# Altium schematic sheet power.SchDoc: Electrical Power System
size A3; Organization: Tweetonig; Address1: Delftsestraat 11; DocumentNumber: 2; Revision: 1.0; SheetNumber: 2; SheetTotal: 9
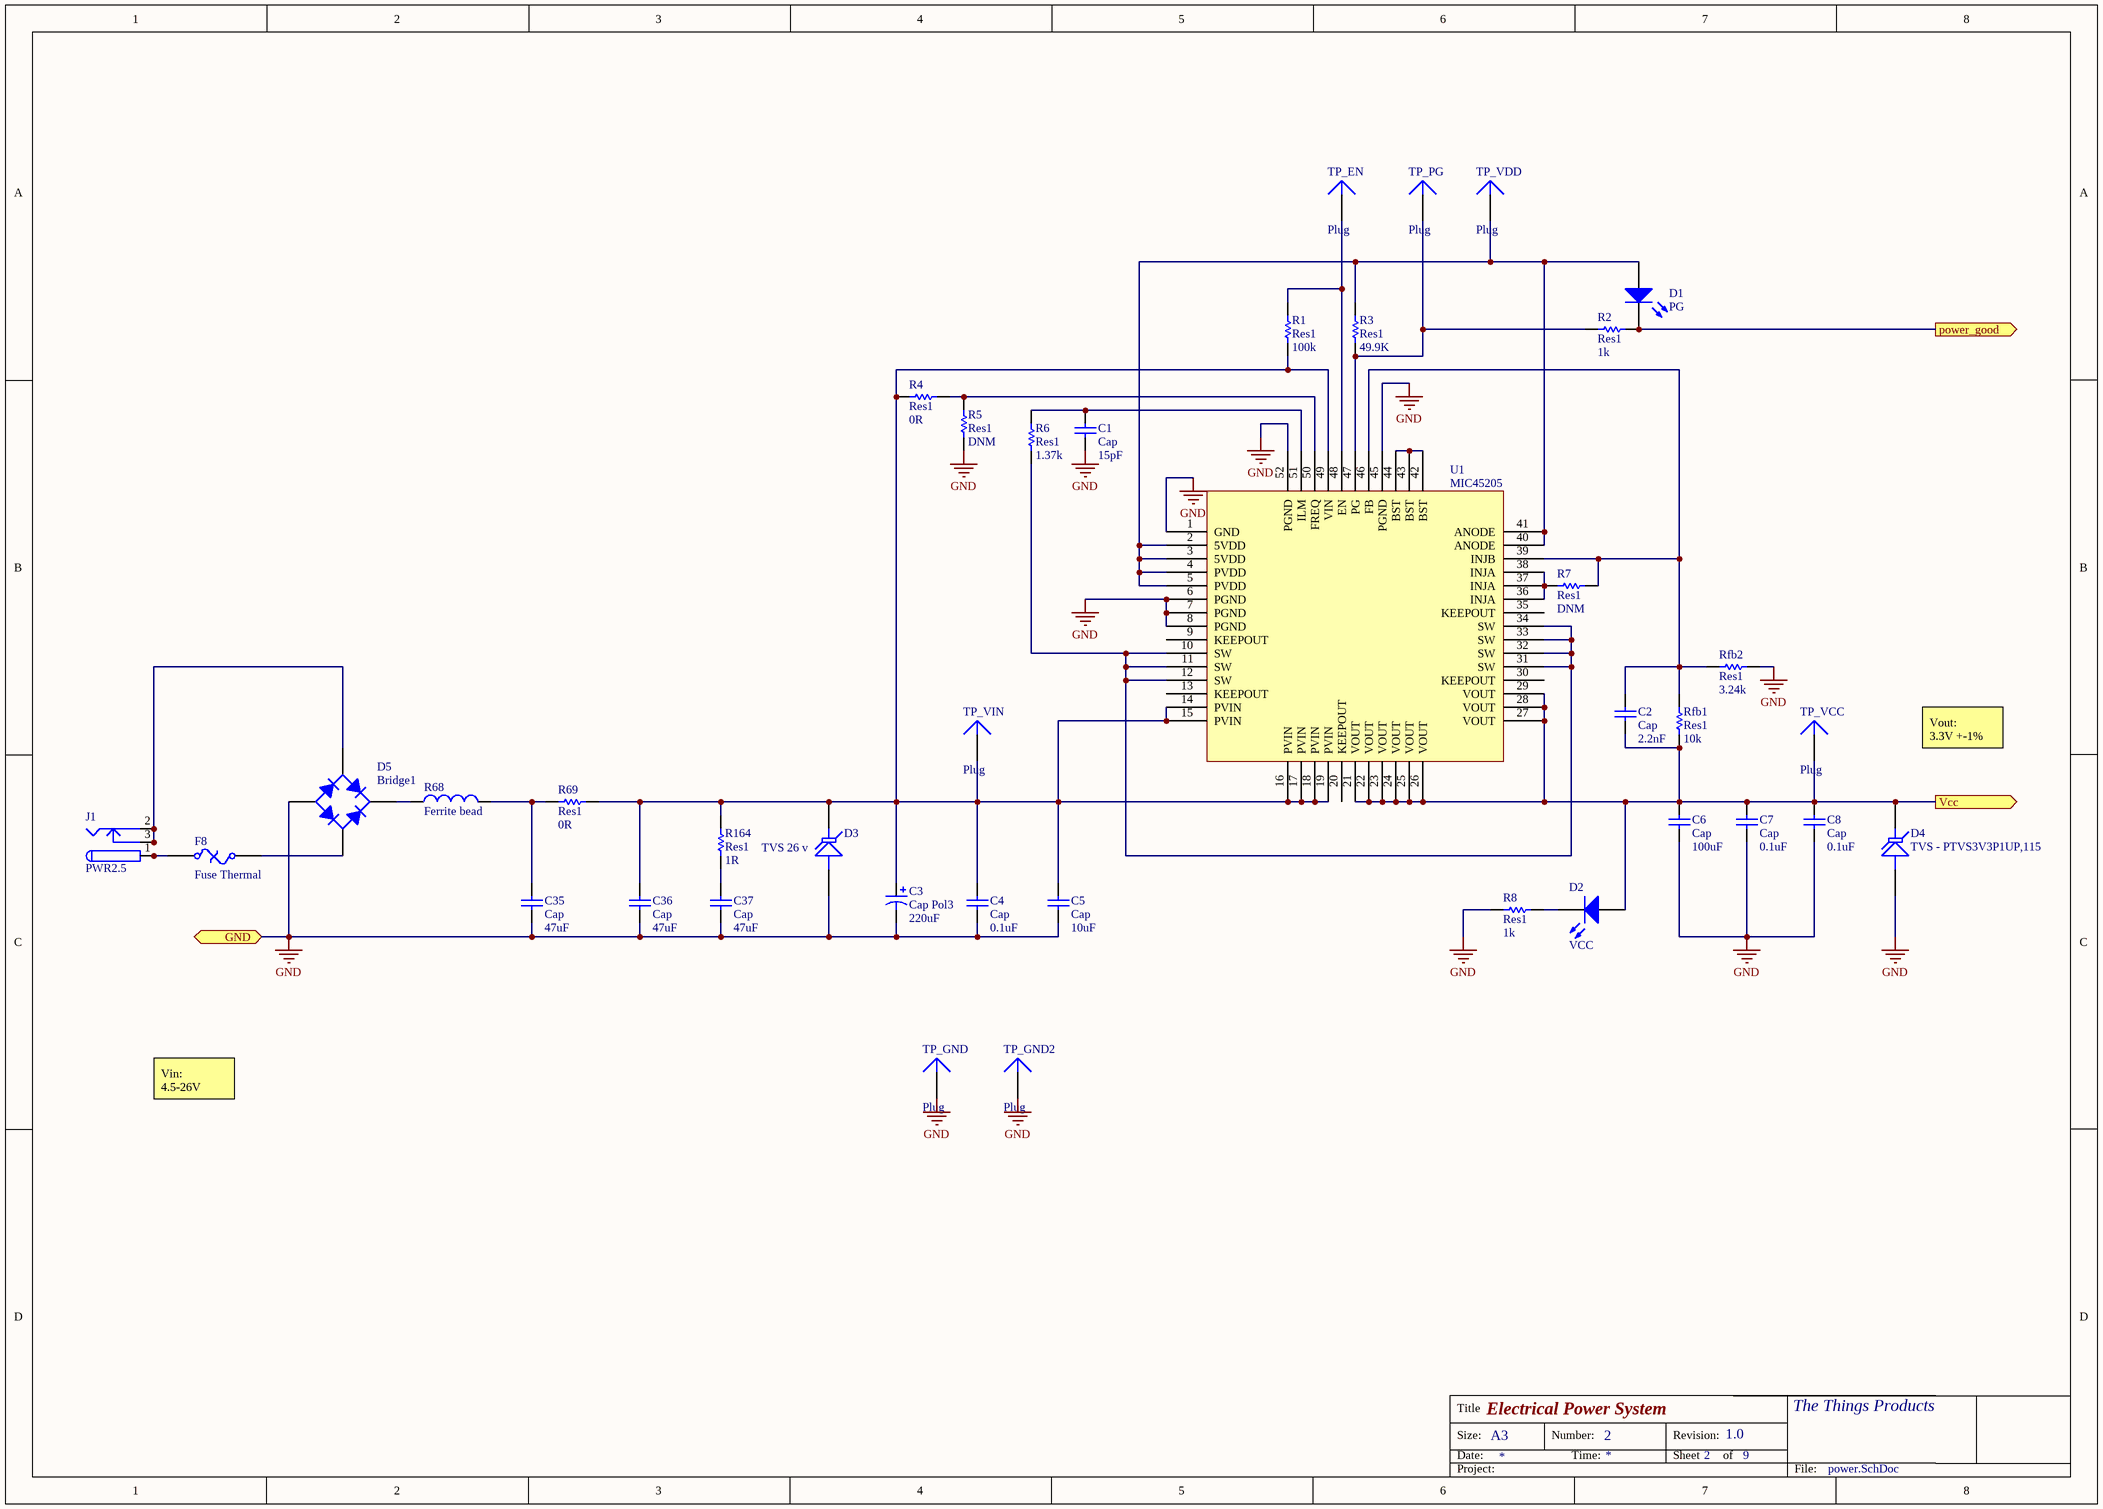
[diagram p0: power.SchDoc]

## Parts
C1  Cap  value 15pF  [C0603]
C2  Cap  value 2.2nF  [C0603]
C3  Cap Pol3  value 220uF  [SMD_CAP_10x7.7mm_220uF - duplicate]
C4  Cap  value 0.1uF  [C1206]
C5  Cap  value 10uF  [C1210]
C6  Cap  value 100uF  [C1210]
C7  Cap  value 0.1uF  [C1206]
C8  Cap  value 0.1uF  [C1206]
C35  Cap  value 47uF  [C1206]
C36  Cap  value 47uF  [C1206]
C37  Cap  value 47uF  [C0603]
D1  PG  [C0603]
D2  VCC  [C0603]
D3  TVS 26 v  [SOD323]
D4  TVS - PTVS3V3P1UP,115  [SOD323]
D5  Bridge1  [4-SDIP]
F8  Fuse Thermal  [1812-polyfuse]
J1  PWR2.5  [KLD-0202]
R1  Res1  value 100k  [R0603]
R2  Res1  value 1k  [R0603]
R3  Res1  value 49.9K  [R0603]
R4  Res1  value 0R  [R0603]
R5  Res1  value DNM  [R0603]
R6  Res1  value 1.37k  [R0603]
R7  Res1  value DNM  [R0603]
R8  Res1  value 1k  [R0603]
R68  Ferrite bead  [R0603]
R69  Res1  value 0R  [R0603]
R164  Res1  value 1R  [R0603]
Rfb1  Res1  value 10k  [R0603]
Rfb2  Res1  value 3.24k  [R0603]
TP_EN  Plug  [PIN1]
TP_GND  Plug  [PIN1]
TP_GND2  Plug  [PIN1]
TP_PG  Plug  [PIN1]
TP_VCC  Plug  [PIN1]
TP_VDD  Plug  [PIN1]
TP_VIN  Plug  [PIN1]
U1  MIC45205  [45205 Thermaly Enhanced]

## Ports
GND (bidir), power_good (out), Vcc (out)

## Nets
GND: C1.1 C3.2 C4.1 C5.1 C6.1 C7.1 C8.1 C35.1 C36.1 C37.1 D3.1(A) D4.1(A) D5.2(A) R5.2 R8.1 Rfb2.1 TP_GND.1 TP_GND2.1 U1.1(GND) U1.6(PGND) U1.7(PGND) U1.8(PGND) U1.45(PGND) U1.52(PGND) ; port GND
power_good: D1.2(K) R2.1 ; port power_good
Vcc: C2.1 C6.2 C7.2 C8.2 D2.1(A) D4.2(K) Rfb1.1 TP_VCC.1 U1.21(VOUT) U1.22(VOUT) U1.23(VOUT) U1.24(VOUT) U1.25(VOUT) U1.26(VOUT) U1.27(VOUT) U1.28(VOUT) U1.29(VOUT) ; port Vcc
NetC1_2: C1.2 R6.2 U1.51(ILM)
NetC2_2: C2.2 R7.1 Rfb1.2 Rfb2.2 U1.39(INJB) U1.46(FB)
NetC3_1: C3.1 C4.2 C5.2 C36.2 D3.2(K) R1.1 R4.2 R69.1 R164.1 TP_VIN.1 U1.14(PVIN) U1.15(PVIN) U1.16(PVIN) U1.17(PVIN) U1.18(PVIN) U1.19(PVIN) U1.49(VIN)
NetC35_2: C35.2 R68.2 R69.2
NetC37_2: C37.2 R164.2
NetD1_1: D1.1(A) R3.1 TP_VDD.1 U1.2(5VDD) U1.3(5VDD) U1.4(PVDD) U1.5(PVDD) U1.40(ANODE) U1.41(ANODE)
NetD2_2: D2.2(K) R8.2
NetD5_1: D5.1(K) R68.1
NetD5_3: D5.3(C) J1.2 J1.2A J1.2B J1.3 J1.3A J1.3B
NetD5_4: D5.4(C) F8.2
NetF8_1: F8.1 J1.1 J1.1A J1.1B
NetR1_2: R1.2 TP_EN.1 U1.48(EN)
NetR2_2: R2.2 R3.2 TP_PG.1 U1.47(PG)
NetR4_1: R4.1 R5.1 U1.50(FREQ)
NetR6_1: R6.1 U1.10(SW) U1.11(SW) U1.12(SW) U1.31(SW) U1.32(SW) U1.33(SW) U1.34(SW)
NetR7_2: R7.2 U1.36(INJA) U1.37(INJA) U1.38(INJA)
NetU1_42: U1.42(BST) U1.43(BST) U1.44(BST)

Not connected (* = marked no-connect by the designer): U1 9(KEEPOUT) 13(KEEPOUT) 20(KEEPOUT) 30(KEEPOUT) 35(KEEPOUT)

## Notes on the sheet
- Vout:
  3.3V +-1%
- Vin:
  4.5-26V
- Title
- Size:
- Date:
- A3
- Number:
- Time:
- Revision:
- Sheet
- of
- The Things Products
- Project:
- File:

## Library data of the parts
C1 C2 C4-C8 C35-C37 = Cap: Capacitor; Published: 8-Jun-2000; LatestRevisionDate: 17-Jul-2002; LatestRevisionNote: Re-released for DXP Platform.; PackageReference: RAD-0.3; Publisher: Altium Limited; PackageDescription: Radial Cap, Thru-Hole; 2 Leads; 0.3 in Pin Spacing
C3 = Cap Pol3: Polarized Capacitor (Surface Mount); Published: 8-Jun-2000; LatestRevisionDate: 29-May-2009; LatestRevisionNote: IPC-7351 Footprint Added.; PackageReference: C0805; Publisher: Altium Limited; PackageDescription: Chip Capacitor
D1 D2 = LED0: Typical INFRARED GaAs LED; Published: 8-Jun-2000; LatestRevisionDate: 08-Jul-2005; LatestRevisionNote: Mech Layer 1 removed.; PackageReference: LED-0; Publisher: Altium Limited; PackageDescription: LED; 2 Leads
D3 D4 = Tranzorb: Transient Voltage Suppression (TVS) Diode; Published: 24-Mar-1999; LatestRevisionDate: 17-Jul-2002; LatestRevisionNote: Re-released for DXP Platform.; PackageReference: DO-7; Publisher: Altium Limited; PackageDescription: Axial Lead Diode
D5 = Bridge1: Full Wave Diode Bridge; Published: 8-Jun-2000; LatestRevisionDate: 29-May-2009; LatestRevisionNote: Sch pins A & K swapped.; DatasheetVersion: E2732B; PackageReference: D-38; Publisher: Altium Limited; PackageDescription: Bridge Rectifier; 4 Terminals; Body 9.4 x 9.4 mm (typ); Pitch 5.08 mm; Supplier 1: Digi-Key; Supplier Part Number 1: DF04SCT-ND; Supplier 2: Farnell; Supplier Part Number 2: 1467469; Datasheet: https://www.digikey.nl/product-detail/en/fairchild-on-semiconductor/DF04S/DF04SCT-ND/965570
F8 = Fuse Thermal: Thermal Fuse; Published: 24-Mar-1999; LatestRevisionDate: 17-Jul-2002; LatestRevisionNote: Re-released for DXP Platform.; PackageReference: PIN-W2/E2.8; Publisher: Altium Limited; PackageDescription: Thru-Hole; 2 Leads
J1 = PWR2.5: Low Voltage Power Supply Connector; Published: 17-Dec-2003; DatasheetDocument: 09-May-2002; Publisher: Altium Limited; ComponentLink1Description: Manufacturer Link; ComponentLink1URL: http://domino.kycon.com/internet/Products.html
R1-R8 R69 R164 Rfb1 Rfb2 = Res1: Resistor; Published: 8-Jun-2000; LatestRevisionDate: 17-Jul-2002; LatestRevisionNote: Re-released for DXP Platform.; PackageReference: AXIAL-0.3; Publisher: Altium Limited; PackageDescription: Axial Device, Thru-Hole; 2 Leads; 0.3 in Pin Spacing
R68 = Inductor: Code_IEC: 1005; Published: 8-Jun-2000; LatestRevisionDate: 29-May-2009; LatestRevisionNote: IPC-7351 Footprint Added.; PackageReference: 0402-A; Publisher: Altium Limited; PackageDescription: Chip Inductor; Code_JEITA: 0402
U1 = MIC45205: MICREL45205 DC/DC Converter
TP_EN TP_GND TP_GND2 TP_PG TP_VCC TP_VDD TP_VIN = Plug: LatestRevisionDate: 17-Jul-2002; LatestRevisionNote: Re-released for DXP Platform.; Publisher: Altium Limited